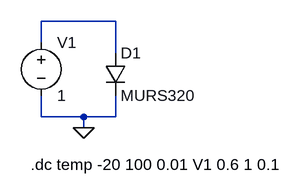
[diagram p0: schematic Fig_3-10_DC_Temp_Diode-temp.asc]
Fig_3-10_DC_Temp_Diode-temp.asc, the LTspice schematic file:
Version 4
SHEET 1 880 680
WIRE 240 80 128 80
WIRE 128 112 128 80
WIRE 240 128 240 80
WIRE 128 224 128 192
WIRE 192 224 128 224
WIRE 240 224 240 192
WIRE 240 224 192 224
WIRE 192 240 192 224
FLAG 192 240 0
SYMBOL diode 224 128 R0
SYMATTR InstName D1
SYMATTR Value MURS320
SYMBOL voltage 128 96 R0
WINDOW 123 0 0 Left 2
WINDOW 39 0 0 Left 2
SYMATTR InstName V1
SYMATTR Value 1
TEXT 112 296 Left 2 !.dc temp -20 100 0.01 V1 0.6 1 0.1

The netlist it stands for:
* Fig_3-10_DC_Temp_Diode-temp.asc
D1 N001 0 MURS320
V1 N001 0 1
.model D D
.lib standard.dio
.dc temp -20 100 0.01 V1 0.6 1 0.1
.backanno
.end